# Altium schematic sheet machcauH.SchDoc: machcauH
size A3; Revision: 1; SheetNumber: 1; SheetTotal: 1
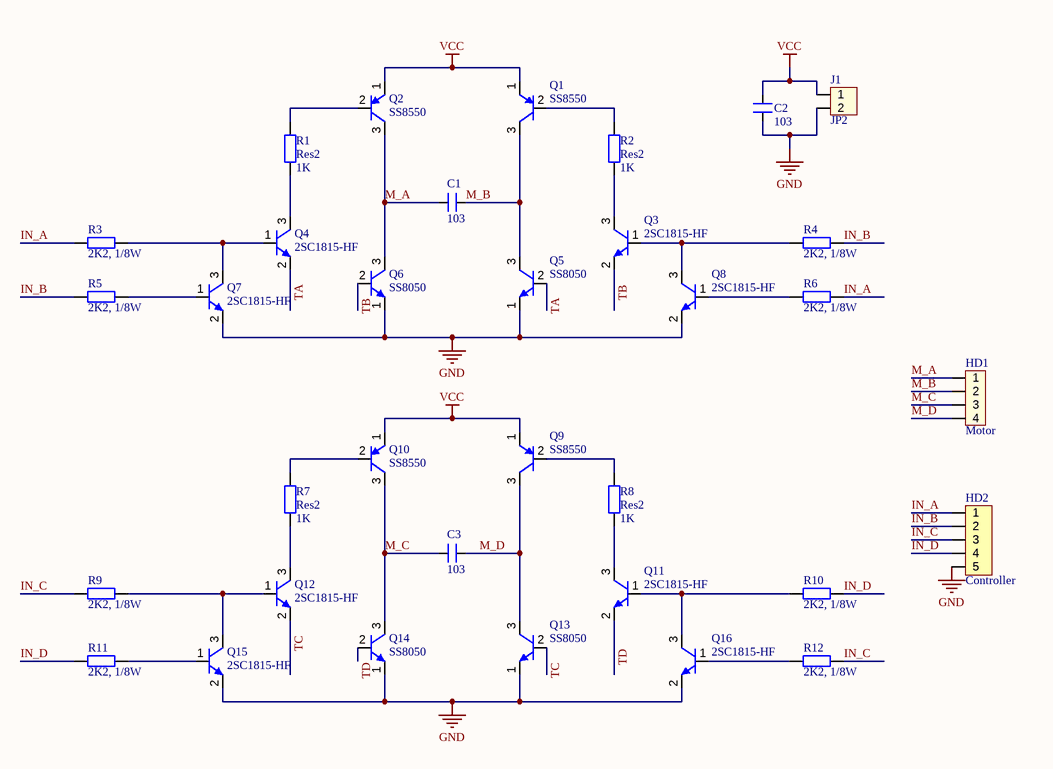
[diagram p0: machcauH.SchDoc]

## Parts
C1  103  [CN1.5]
C2  103  [CN1.5]
C3  103  [CN1.5]
HD1  Motor  [Header_4]
HD2  Controller  [HDR5]
J1  JP2  [CON2]
Q1  SS8550  [SS8550]
Q2  SS8550  [SS8550]
Q3  2SC1815-HF  [2SC1815-HF]
Q4  2SC1815-HF  [2SC1815-HF]
Q5  SS8050  [SS8050]
Q6  SS8050  [SS8050]
Q7  2SC1815-HF  [2SC1815-HF]
Q8  2SC1815-HF  [2SC1815-HF]
Q9  SS8550  [SS8550]
Q10  SS8550  [SS8550]
Q11  2SC1815-HF  [2SC1815-HF]
Q12  2SC1815-HF  [2SC1815-HF]
Q13  SS8050  [SS8050]
Q14  SS8050  [SS8050]
Q15  2SC1815-HF  [2SC1815-HF]
Q16  2SC1815-HF  [2SC1815-HF]
R1  Res2  value 1K  [RES 1/4W CFR25]
R2  Res2  value 1K  [RES 1/4W CFR25]
R3  value 2K2, 1/8W  [DIEN TRO 0805]  (hidden comment: R0603)
R4  value 2K2, 1/8W  [DIEN TRO 0805]  (hidden comment: R0603)
R5  value 2K2, 1/8W  [DIEN TRO 0805]  (hidden comment: R0603)
R6  value 2K2, 1/8W  [DIEN TRO 0805]  (hidden comment: R0603)
R7  Res2  value 1K  [RES 1/4W CFR25]
R8  Res2  value 1K  [RES 1/4W CFR25]
R9  value 2K2, 1/8W  [DIEN TRO 0805]  (hidden comment: R0603)
R10  value 2K2, 1/8W  [DIEN TRO 0805]  (hidden comment: R0603)
R11  value 2K2, 1/8W  [DIEN TRO 0805]  (hidden comment: R0603)
R12  value 2K2, 1/8W  [DIEN TRO 0805]  (hidden comment: R0603)

## Nets
GND: C2.1 HD2.5 J1.2 Q5.1(E) Q6.1(E) Q7.2(E) Q8.2(E) Q13.1(E) Q14.1(E) Q15.2(E) Q16.2(E)
VCC: C2.2 J1.1 Q1.1(E) Q2.1(E) Q9.1(E) Q10.1(E)
IN_A: HD2.1 R3.1 R6.2
IN_B: HD2.2 R4.2 R5.1
IN_C: HD2.3 R9.1 R12.2
IN_D: HD2.4 R10.2 R11.1
M_A: C1.1 HD1.1 Q2.3(C) Q6.3(C)
M_B: C1.2 HD1.2 Q1.3(C) Q5.3(C)
M_C: C3.2 HD1.3 Q10.3(C) Q14.3(C)
M_D: C3.1 HD1.4 Q9.3(C) Q13.3(C)
TA: Q4.2(E) Q5.2(B)
TB: Q3.2(E) Q6.2(B)
TC: Q12.2(E) Q13.2(B)
TD: Q11.2(E) Q14.2(B)
NetQ1_2: Q1.2(B) R2.2
NetQ2_2: Q2.2(B) R1.2
NetQ3_1: Q3.1(B) Q8.3(C) R4.1
NetQ3_3: Q3.3(C) R2.1
NetQ4_1: Q4.1(B) Q7.3(C) R3.2
NetQ4_3: Q4.3(C) R1.1
NetQ7_1: Q7.1(B) R5.2
NetQ8_1: Q8.1(B) R6.1
NetQ9_2: Q9.2(B) R8.2
NetQ10_2: Q10.2(B) R7.2
NetQ11_1: Q11.1(B) Q16.3(C) R10.1
NetQ11_3: Q11.3(C) R8.1
NetQ12_1: Q12.1(B) Q15.3(C) R9.2
NetQ12_3: Q12.3(C) R7.1
NetQ15_1: Q15.1(B) R11.2
NetQ16_1: Q16.1(B) R12.1

## Notes on the sheet
- THIS DOCUMENT AND THE DATA DISCLOSED HEREIN OR
- HEREWITH IS THE PROPERTY OF ALTIUM LIMITED AND MAY
- DWG NO:
- REVISION
- REV:
- DESCRIPTION
- DATE
- APPROVED
- BE FREELY DISTRIBUTED IN WHOLE. NO RIGHTS ARE
- RESERVED OR EXPRESS OR IMPLIED WARANTEE GIVEN.
- ENG:
- APPROVALS
- PROJECT
- DSN:
- CHK:
- REFERENCE DOCUMENTS
- PROJECT REVISION:
- TITLE
- DOCUMENT REVISION:
- DESIGN ITEM:
- BOM:
- FAB DWG:
- PCB DWG:
- ASSY DWG:
- SCALE:
- A3
- SIZE
- CAGE CODE
- FILE NAME
- DWG NO.
- SHEET
- OF
- REV

## Library data of the parts
C1-C3 = CN1.5: Cap np 682pF => 104pF; Value: 0.01uF
HD1 = Header4: Header 4; Value: Header 4
HD2 = Header5: Header IDC, 5 x 1 Pin Vertical 2.54mm Pitch (Non-Boxed, Male); Manufacturer: W¨¹rth Elektronik eiSos GmbH; partNo: 613002143121; ComponentLink1 Description: Manufacturer; ComponentLink2 Description: Datasheet; NoPins: 02; Created Date: 29 March 2013; ComponentLink1URL: http://www.we-online.com; ComponentLink2URL: http://katalog.we-online.de/em/datasheet/6130xx143121.pdf; Created by: Karrer Zheng
J1 = Con2: Connector 2; Value: Connector 2
Q1 Q2 Q9 Q10 = SS8550: Trans PNP -25V -1.5A TO-92; ComponentLink1Description: Datasheet; ComponentLink1URL: D:\Dropbox\Datasheets\Transistors\N Channel Bipolar\SS8550.pdf; Unit Price: 0.0476
Q3 Q4 Q7 Q8 Q11 Q12 Q15 Q16 = 2SC1815-HF: Trans NPN 50V 150mA SOT-23; ComponentLink1Description: Datasheet; ComponentLink1URL: D:\Dropbox\Datasheets\Transistors\P Channel Bipolar\2SC1815-HF.pdf; Unit Price: 0.0286
Q5 Q6 Q13 Q14 = SS8050: Trans NPN 25V 1.5A TO-92; ComponentLink1Description: Datasheet; ComponentLink1URL: D:\Dropbox\Datasheets\Transistors\P Channel Bipolar\SS8050.pdf; Unit Price: 0.0476
R1 R2 R7 R8 = Res2: Resistor; Published: 8-Jun-2000; LatestRevisionDate: 17-Jul-2002; LatestRevisionNote: Re-released for DXP Platform.; PackageReference: AXIAL-0.4; Publisher: Altium Limited; PackageDescription: Axial Device, Thru-Hole; 2 Leads; 0.4 in Pin Spacing
R3-R6 R9-R12 = R0603: Resistor SMD 0603; Published: 8-Jun-2000; LatestRevisionDate: 17-Jul-2002; LatestRevisionNote: Re-released for DXP Platform.; PackageReference: AXIAL-0.4; Publisher: Altium Limited